# EAGLE design RQ2_mainboard (EAGLE 7.7.0)
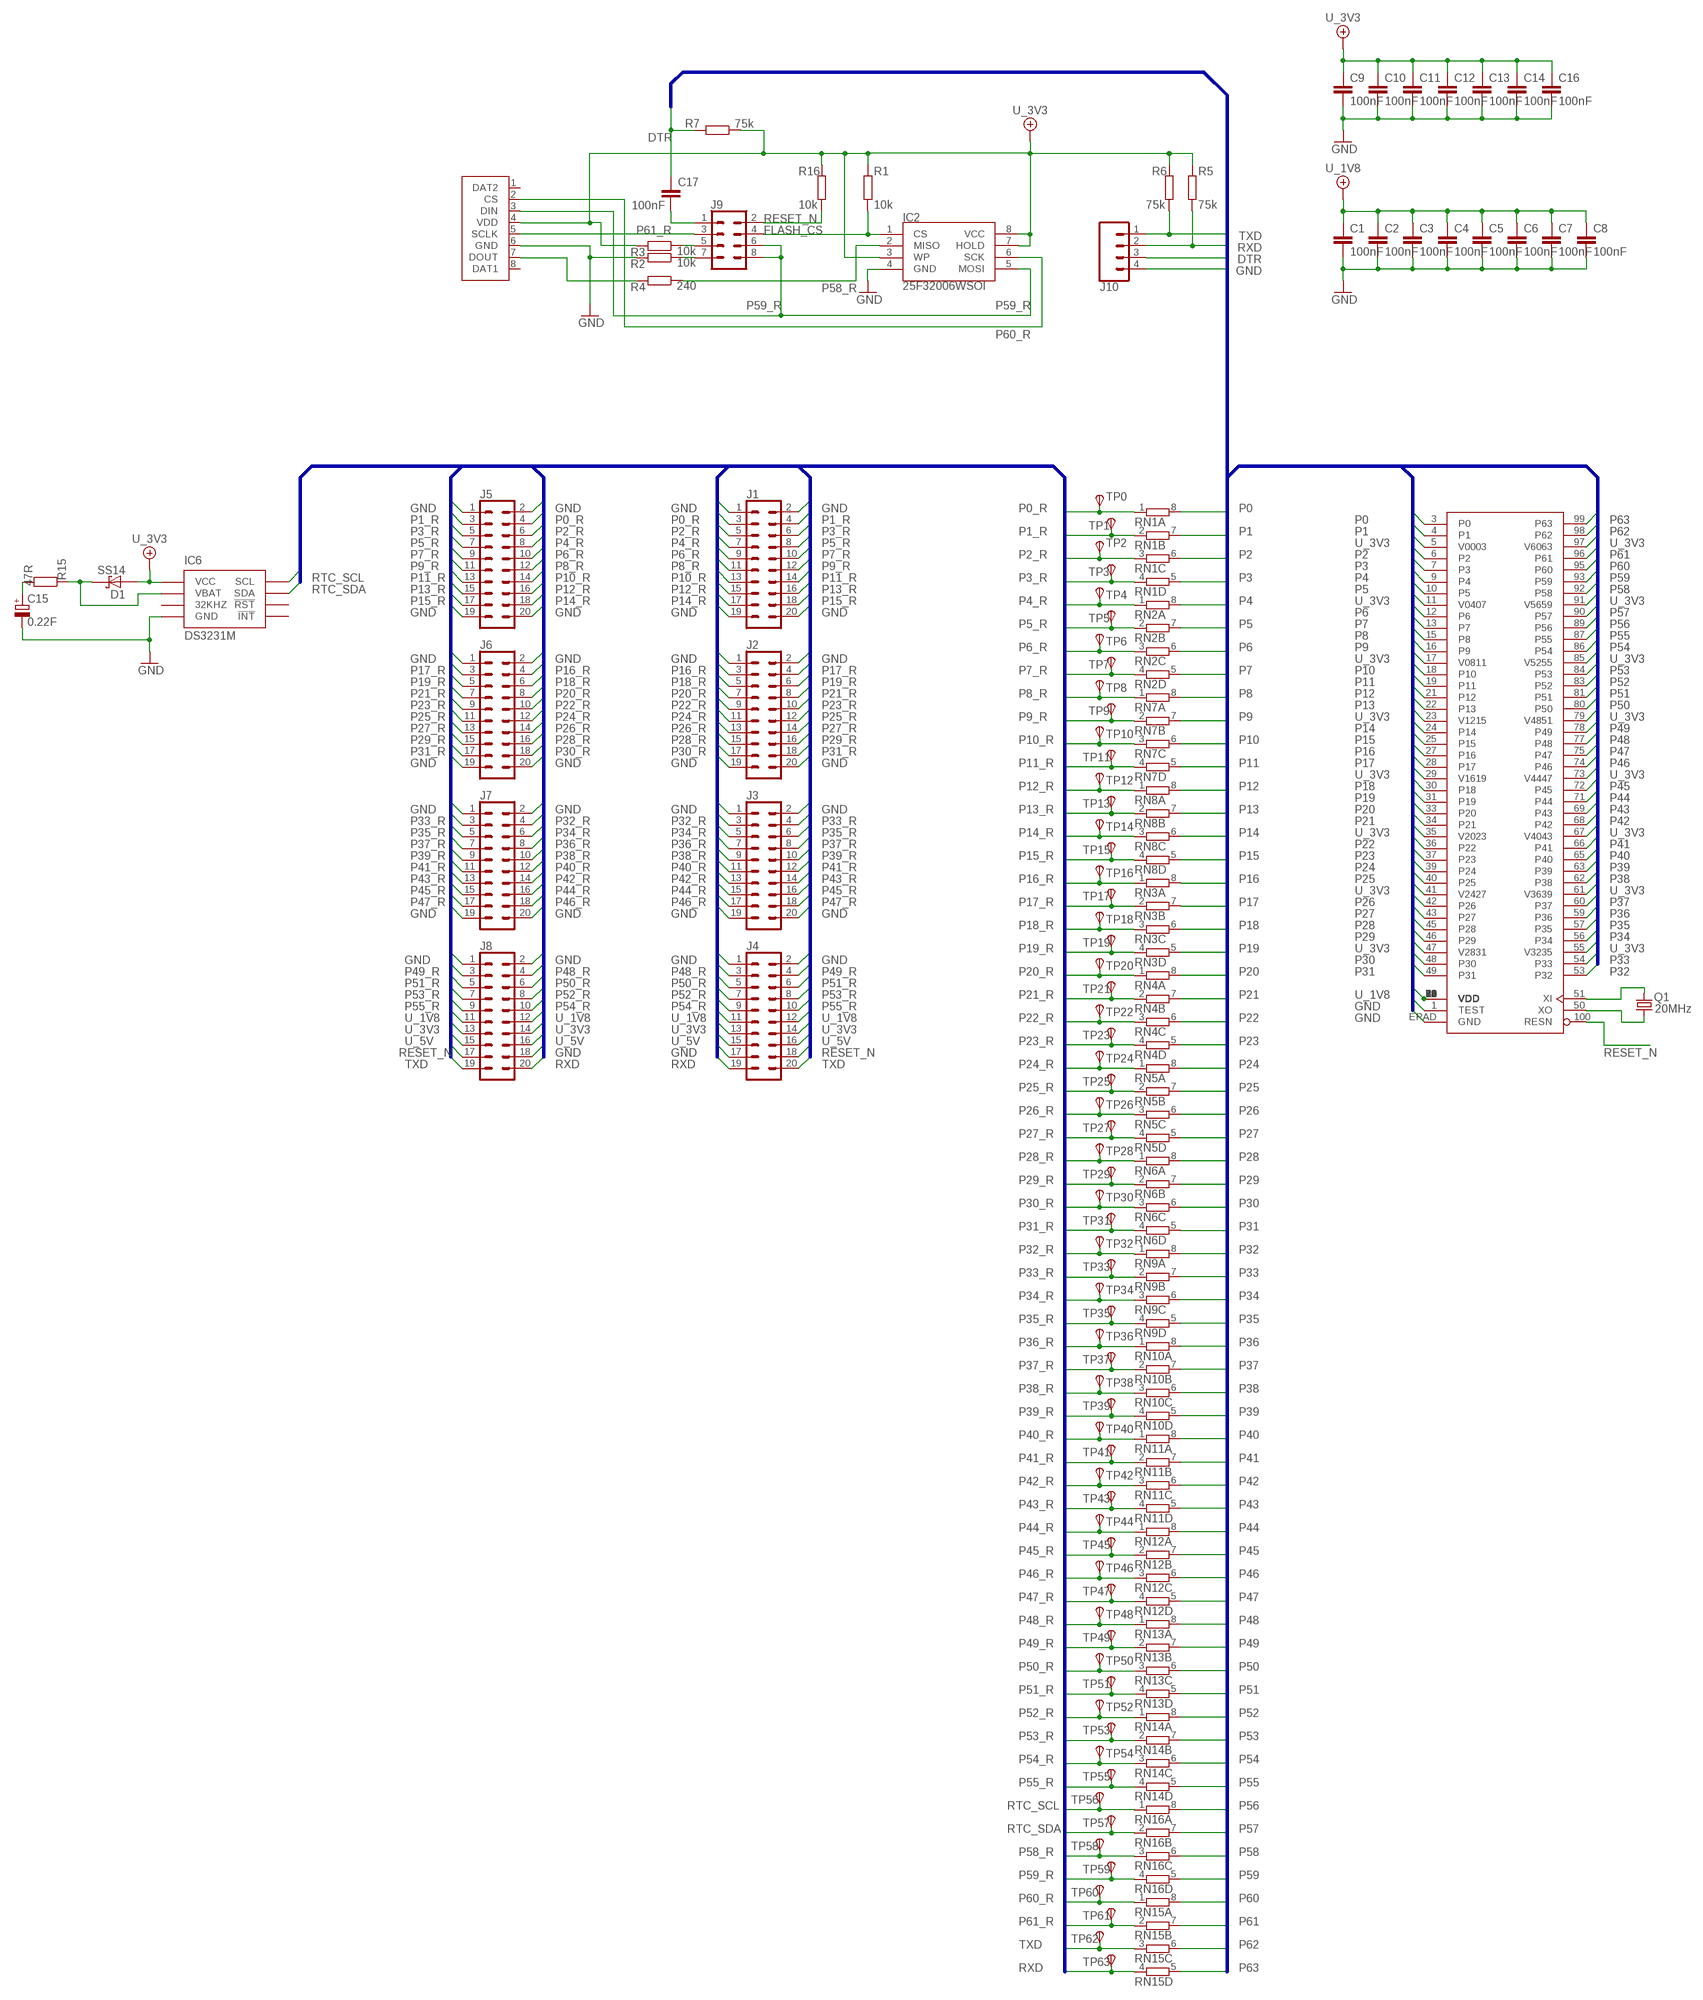
[diagram p0: schematic, sheet 1]

## Parts
C1  100nF  C-EUC0805  [C0805]
C2  100nF  C-EUC0805  [C0805]
C3  100nF  C-EUC0805  [C0805]
C4  100nF  C-EUC0805  [C0805]
C5  100nF  C-EUC0805  [C0805]
C6  100nF  C-EUC0805  [C0805]
C7  100nF  C-EUC0805  [C0805]
C8  100nF  C-EUC0805  [C0805]
C9  100nF  C-EUC0805  [C0805]
C10  100nF  C-EUC0805  [C0805]
C11  100nF  C-EUC0805  [C0805]
C12  100nF  C-EUC0805  [C0805]
C13  100nF  C-EUC0805  [C0805]
C14  100nF  C-EUC0805  [C0805]
C15  0.22F  CPOL-EUDHL_21.5  [DHL_21.5]
C16  100nF  C-EUC0805  [C0805]
C17  100nF  C-EUC0805  [C0805]
D1  SS14  [SMA_403D]
IC1  P2X8C4M64P  [TQFP100]
IC2  25F32006WSOI  SPI_FLASH-X25XXSMD1  [SO08-EIAJ]
IC6  DS3231M  [SO-8]
J1  CONN_10X2SMT  [2X10_SMT]
J2  CONN_10X2SMT  [2X10_SMT]
J3  CONN_10X2SMT  [2X10_SMT]
J4  CONN_10X2SMT  [2X10_SMT]
J5  CONN_10X2SMT  [2X10_SMT]
J6  CONN_10X2SMT  [2X10_SMT]
J7  CONN_10X2SMT  [2X10_SMT]
J8  CONN_10X2SMT  [2X10_SMT]
J9  CONN_04X2  [2X4]
J10  CONN_04  [1X04]
Q1  20MHz  CRYSTALSMD-5X3.2-2PAD  [CRYSTAL-SMD-5X3.2-2PAD]
R1  10k  R-EU_R0603  [R0603]
R2  10k  R-EU_R0603  [R0603]
R3  10k  R-EU_R0603  [R0603]
R4  240  R-EU_R0603  [R0603]
R5  75k  R-EU_R0603  [R0603]
R6  75k  R-EU_R0603  [R0603]
R7  75k  R-EU_R0603  [R0603]
R15  47R  R-EU_R0603  [R0603]
R16  10k  R-EU_R0603  [R0603]
RN1  4R-N0603-ARV  [0603-ARV]
RN2  4R-N0603-ARV  [0603-ARV]
RN3  4R-N0603-ARV  [0603-ARV]
RN4  4R-N0603-ARV  [0603-ARV]
RN5  4R-N0603-ARV  [0603-ARV]
RN6  4R-N0603-ARV  [0603-ARV]
RN7  4R-N0603-ARV  [0603-ARV]
RN8  4R-N0603-ARV  [0603-ARV]
RN9  4R-N0603-ARV  [0603-ARV]
RN10  4R-N0603-ARV  [0603-ARV]
RN11  4R-N0603-ARV  [0603-ARV]
RN12  4R-N0603-ARV  [0603-ARV]
RN13  4R-N0603-ARV  [0603-ARV]
RN14  4R-N0603-ARV  [0603-ARV]
RN15  4R-N0603-ARV  [0603-ARV]
RN16  4R-N0603-ARV  [0603-ARV]
TP0  TPSB1,27  [B1,27]
TP1  TPSB1,27  [B1,27]
TP2  TPSB1,27  [B1,27]
TP3  TPSB1,27  [B1,27]
TP4  TPSB1,27  [B1,27]
TP5  TPSB1,27  [B1,27]
TP6  TPSB1,27  [B1,27]
TP7  TPSB1,27  [B1,27]
TP8  TPSB1,27  [B1,27]
TP9  TPSB1,27  [B1,27]
TP10  TPSB1,27  [B1,27]
TP11  TPSB1,27  [B1,27]
TP12  TPSB1,27  [B1,27]
TP13  TPSB1,27  [B1,27]
TP14  TPSB1,27  [B1,27]
TP15  TPSB1,27  [B1,27]
TP16  TPSB1,27  [B1,27]
TP17  TPSB1,27  [B1,27]
TP18  TPSB1,27  [B1,27]
TP19  TPSB1,27  [B1,27]
TP20  TPSB1,27  [B1,27]
TP21  TPSB1,27  [B1,27]
TP22  TPSB1,27  [B1,27]
TP23  TPSB1,27  [B1,27]
TP24  TPSB1,27  [B1,27]
TP25  TPSB1,27  [B1,27]
TP26  TPSB1,27  [B1,27]
TP27  TPSB1,27  [B1,27]
TP28  TPSB1,27  [B1,27]
TP29  TPSB1,27  [B1,27]
TP30  TPSB1,27  [B1,27]
TP31  TPSB1,27  [B1,27]
TP32  TPSB1,27  [B1,27]
TP33  TPSB1,27  [B1,27]
TP34  TPSB1,27  [B1,27]
TP35  TPSB1,27  [B1,27]
TP36  TPSB1,27  [B1,27]
TP37  TPSB1,27  [B1,27]
TP38  TPSB1,27  [B1,27]
TP39  TPSB1,27  [B1,27]
TP40  TPSB1,27  [B1,27]
TP41  TPSB1,27  [B1,27]
TP42  TPSB1,27  [B1,27]
TP43  TPSB1,27  [B1,27]
TP44  TPSB1,27  [B1,27]
TP45  TPSB1,27  [B1,27]
TP46  TPSB1,27  [B1,27]
TP47  TPSB1,27  [B1,27]
TP48  TPSB1,27  [B1,27]
TP49  TPSB1,27  [B1,27]
TP50  TPSB1,27  [B1,27]
TP51  TPSB1,27  [B1,27]
TP52  TPSB1,27  [B1,27]
TP53  TPSB1,27  [B1,27]
TP54  TPSB1,27  [B1,27]
TP55  TPSB1,27  [B1,27]
TP56  TPSB1,27  [B1,27]
TP57  TPSB1,27  [B1,27]
TP58  TPSB1,27  [B1,27]
TP59  TPSB1,27  [B1,27]
TP60  TPSB1,27  [B1,27]
TP61  TPSB1,27  [B1,27]
TP62  TPSB1,27  [B1,27]
TP63  TPSB1,27  [B1,27]
X1  MICRO_SD_CONNECTORMOLEX_HINGE  [MICRO_SD]

## Nets
DTR: C17.1 J10.3 R7.2
DTR_C: C17.2 J9.1
FLASH_CS: IC2.1(CS) J9.4 R1.1
GND: C1.2 C2.2 C3.2 C4.2 C5.2 C6.2 C7.2 C8.2 C9.2 C10.2 C11.2 C12.2 C13.2 C14.2 C15.- C16.2 IC1.1(TEST) IC1.EPAD(GND) IC2.4(GND) IC6.5(GND) J1.1 J1.2 J1.19 J1.20 J2.1 J2.2 J2.19 J2.20 J3.1 J3.2 J3.19 J3.20 J4.1 J4.2 J4.17 J5.1 J5.2 J5.19 J5.20 J6.1 J6.2 J6.19 J6.20 J7.1 J7.2 J7.19 J7.20 J8.1 J8.2 J8.18 J10.4 R2.2 X1.6(GND)
N$7: J9.7 R2.1
N$8: J9.5 R3.1
P0: IC1.3(P0) RN1.8
P0_R: J1.3 J5.4 RN1.1 TP0.TP(PP)
P1: IC1.4(P1) RN1.7
P1_R: J1.4 J5.3 RN1.2 TP1.TP(PP)
P2: IC1.6(P2) RN1.6
P2_R: J1.5 J5.6 RN1.3 TP2.TP(PP)
P3: IC1.7(P3) RN1.5
P3_R: J1.6 J5.5 RN1.4 TP3.TP(PP)
P4: IC1.9(P4) RN2.8
P4_R: J1.7 J5.8 RN2.1 TP4.TP(PP)
P5: IC1.10(P5) RN2.7
P5_R: J1.8 J5.7 RN2.2 TP5.TP(PP)
P6: IC1.12(P6) RN2.6
P6_R: J1.9 J5.10 RN2.3 TP6.TP(PP)
P7: IC1.13(P7) RN2.5
P7_R: J1.10 J5.9 RN2.4 TP7.TP(PP)
P8: IC1.15(P8) RN7.8
P8_R: J1.11 J5.12 RN7.1 TP8.TP(PP)
P9: IC1.16(P9) RN7.7
P9_R: J1.12 J5.11 RN7.2 TP9.TP(PP)
P10: IC1.18(P10) RN7.6
P10_R: J1.13 J5.14 RN7.3 TP10.TP(PP)
P11: IC1.19(P11) RN7.5
P11_R: J1.14 J5.13 RN7.4 TP11.TP(PP)
P12: IC1.21(P12) RN8.8
P12_R: J1.15 J5.16 RN8.1 TP12.TP(PP)
P13: IC1.22(P13) RN8.7
P13_R: J1.16 J5.15 RN8.2 TP13.TP(PP)
P14: IC1.24(P14) RN8.6
P14_R: J1.17 J5.18 RN8.3 TP14.TP(PP)
P15: IC1.25(P15) RN8.5
P15_R: J1.18 J5.17 RN8.4 TP15.TP(PP)
P16: IC1.27(P16) RN3.8
P16_R: J2.3 J6.4 RN3.1 TP16.TP(PP)
P17: IC1.28(P17) RN3.7
P17_R: J2.4 J6.3 RN3.2 TP17.TP(PP)
P18: IC1.30(P18) RN3.6
P18_R: J2.5 J6.6 RN3.3 TP18.TP(PP)
P19: IC1.31(P19) RN3.5
P19_R: J2.6 J6.5 RN3.4 TP19.TP(PP)
P20: IC1.33(P20) RN4.8
P20_R: J2.7 J6.8 RN4.1 TP20.TP(PP)
P21: IC1.34(P21) RN4.7
P21_R: J2.8 J6.7 RN4.2 TP21.TP(PP)
P22: IC1.36(P22) RN4.6
P22_R: J2.9 J6.10 RN4.3 TP22.TP(PP)
P23: IC1.37(P23) RN4.5
P23_R: J2.10 J6.9 RN4.4 TP23.TP(PP)
P24: IC1.39(P24) RN5.8
P24_R: J2.11 J6.12 RN5.1 TP24.TP(PP)
P25: IC1.40(P25) RN5.7
P25_R: J2.12 J6.11 RN5.2 TP25.TP(PP)
P26: IC1.42(P26) RN5.6
P26_R: J2.13 J6.14 RN5.3 TP26.TP(PP)
P27: IC1.43(P27) RN5.5
P27_R: J2.14 J6.13 RN5.4 TP27.TP(PP)
P28: IC1.45(P28) RN6.8
P28_R: J2.15 J6.16 RN6.1 TP28.TP(PP)
P29: IC1.46(P29) RN6.7
P29_R: J2.16 J6.15 RN6.2 TP29.TP(PP)
P30: IC1.48(P30) RN6.6
P30_R: J2.17 J6.18 RN6.3 TP30.TP(PP)
P31: IC1.49(P31) RN6.5
P31_R: J2.18 J6.17 RN6.4 TP31.TP(PP)
P32: IC1.53(P32) RN9.8
P32_R: J3.3 J7.4 RN9.1 TP32.TP(PP)
P33: IC1.54(P33) RN9.7
P33_R: J3.4 J7.3 RN9.2 TP33.TP(PP)
P34: IC1.56(P34) RN9.6
P34_R: J3.5 J7.6 RN9.3 TP34.TP(PP)
P35: IC1.57(P35) RN9.5
P35_R: J3.6 J7.5 RN9.4 TP35.TP(PP)
P36: IC1.59(P36) RN10.8
P36_R: J3.7 J7.8 RN10.1 TP36.TP(PP)
P37: IC1.60(P37) RN10.7
P37_R: J3.8 J7.7 RN10.2 TP37.TP(PP)
P38: IC1.62(P38) RN10.6
P38_R: J3.9 J7.10 RN10.3 TP38.TP(PP)
P39: IC1.63(P39) RN10.5
P39_R: J3.10 J7.9 RN10.4 TP39.TP(PP)
P40: IC1.65(P40) RN11.8
P40_R: J3.11 J7.12 RN11.1 TP40.TP(PP)
P41: IC1.66(P41) RN11.7
P41_R: J3.12 J7.11 RN11.2 TP41.TP(PP)
P42: IC1.68(P42) RN11.6
P42_R: J3.13 J7.14 RN11.3 TP42.TP(PP)
P43: IC1.69(P43) RN11.5
P43_R: J3.14 J7.13 RN11.4 TP43.TP(PP)
P44: IC1.71(P44) RN12.8
P44_R: J3.15 J7.16 RN12.1 TP44.TP(PP)
P45: IC1.72(P45) RN12.7
P45_R: J3.16 J7.15 RN12.2 TP45.TP(PP)
P46: IC1.74(P46) RN12.6
P46_R: J3.17 J7.18 RN12.3 TP46.TP(PP)
P47: IC1.75(P47) RN12.5
P47_R: J3.18 J7.17 RN12.4 TP47.TP(PP)
P48: IC1.77(P48) RN13.8
P48_R: J4.3 J8.4 RN13.1 TP48.TP(PP)
P49: IC1.78(P49) RN13.7
P49_R: J4.4 J8.3 RN13.2 TP49.TP(PP)
P50: IC1.80(P50) RN13.6
P50_R: J4.5 J8.6 RN13.3 TP50.TP(PP)
P51: IC1.81(P51) RN13.5
P51_R: J4.6 J8.5 RN13.4 TP51.TP(PP)
P52: IC1.83(P52) RN14.8
P52_R: J4.7 J8.8 RN14.1 TP52.TP(PP)
P53: IC1.84(P53) RN14.7
P53_R: J4.8 J8.7 RN14.2 TP53.TP(PP)
P54: IC1.86(P54) RN14.6
P54_R: J4.9 J8.10 RN14.3 TP54.TP(PP)
P55: IC1.87(P55) RN14.5
P55_R: J4.10 J8.9 RN14.4 TP55.TP(PP)
P56: IC1.89(P56) RN16.8
P57: IC1.90(P57) RN16.7
P58: IC1.92(P58) RN16.6
P58_R: IC2.2(MISO) R4.1 RN16.3 TP58.TP(PP)
P59: IC1.93(P59) RN16.5
P59_R: IC2.5(MOSI) J9.6 J9.8 RN16.4 TP59.TP(PP) X1.3(DIN)
P60: IC1.95(P60) RN15.8
P60_R: IC2.6(SCK) RN15.1 TP60.TP(PP) X1.2(CS)
P61: IC1.96(P61) RN15.7
P61_R: J9.3 RN15.2 TP61.TP(PP) X1.5(SCLK)
P62: IC1.98(P62) RN15.6
P63: IC1.99(P63) RN15.5
RESET_N: IC1.100(RESN) J4.18 J8.17 J9.2 R16.1
RTC_SCL: IC6.8(SCL) RN16.1 TP56.TP(PP)
RTC_SDA: IC6.7(SDA) RN16.2 TP57.TP(PP)
RXD: J4.19 J8.20 J10.2 R5.1 RN15.4 TP63.TP(PP)
SD_DOUT: R4.2 X1.7(DOUT)
TXD: J4.20 J8.19 J10.1 R6.1 RN15.3 TP62.TP(PP)
U_1V8: C1.1 C2.1 C3.1 C4.1 C5.1 C6.1 C7.1 C8.1 IC1.2(VDD) J4.11 J4.12 J8.11 J8.12
U_3V3: C9.1 C10.1 C11.1 C12.1 C13.1 C14.1 C16.1 D1.A IC1.5(V0003) IC1.11(V0407) IC1.17(V0811) IC1.23(V1215) IC1.29(V1619) IC1.35(V2023) IC1.41(V2427) IC1.47(V2831) IC1.55(V3235) IC1.61(V3639) IC1.67(V4043) IC1.73(V4447) IC1.79(V4851) IC1.85(V5255) IC1.91(V5659) IC1.97(V6063) IC2.3(WP) IC2.7(HOLD) IC2.8(VCC) IC6.2(VCC) J4.13 J4.14 J8.13 J8.14 R1.2 R3.2 R5.2 R6.2 R7.1 R16.2 X1.4(VDD)
U_5V: J4.15 J4.16 J8.15 J8.16
VBAT: D1.C IC6.6(VBAT) R15.1
VCAP: C15.+ R15.2
XIN: IC1.51(XI) Q1.P$2
XOUT: IC1.50(XO) Q1.P$1
Unconnected: IC6.1(32KHZ) IC6.3(!INT) IC6.4(!RST) X1.1(DAT2) X1.8(DAT1)

## Buses
P[0..63],RAM_A_CS,FLASH_A_CS,RAM_B_CS,FLASH_B_CS,FLASH_A_INT,FLASH_B_INT,SPI_SCLK[0..3],SPI_MOSI[0..3],SPI_MISO[0..3],SPI_SS[0..3],I2C_SCL[0..3],I2C_SDA[0..3],SD0_CLK,SD0_CMD,SD0_DAT[0..3],SD1_CLK,SD1_CMD,SD1_DAT[0..3],GPIO[0..15],PWM[0..7],UART_RX[0..3],UART_TX[0..3],RXD,TXD,BOOT_SCLK,BOOT_MISO,BOOT_MOSI,SD_CLK,RESET_N,DTR,XIN,XOUT,U_1V8,U_3V3,U_5V,U_IN,GND
P40_R,P41_R,P42_R,P43_R,P44_R,P45_R,P46_R,P47_R,P48_R,P49_R,P50_R,P51_R,P52_R,P53_R,P54_R,P55_R,I2C_SCL[0..3],I2C_SDA[0..3],RTC_SCL,RTC_SDA,SD_CLK,SD_CMD,SD_DAT[0..3],GPIO[0..7],ADC[0..7],PWM[0..15],UART_RX[0..3],UART_TX[0..3],PORT[0..7],RXD,TXD,BOOT_SCLK,BOOT_MISO,BOOT_MOSI,RESET_N,XIN,XOUT,U_1V8,U_3V3,U_5V,U_IN,GND

## Power pins joined to a net without a drawn wire
U_1V8: IC1.8(VDD) IC1.14(VDD) IC1.20(VDD) IC1.26(VDD) IC1.32(VDD) IC1.38(VDD) IC1.44(VDD) IC1.52(VDD) IC1.58(VDD) IC1.64(VDD) IC1.70(VDD) IC1.76(VDD) IC1.82(VDD) IC1.88(VDD) IC1.94(VDD)

## Library data of the parts
C1-C14 C16 C17 = rcl:C-EU: CAPACITOR, European symbol
C15 = rcl_updated:CPOL-EU: POLARIZED CAPACITOR, European symbol
D1 = adafruit:SS14
IC1 = parallax:P2X8C4M64P
IC2 = SparkFun-IC-Memory:SPI_FLASH-X25XX: 32M Serial Flash Memory 8pin SPI Flash series x25xx. Works with devices like W25X32 and BR25L32 Datasheet <http://www.macronix.com/Lists/Datasheet/Attachments/5031/MX25L3206E,%203V,%2032Mb,%20v1.5.pdf> SparkFun Products SparkFun Venus GPS Logger <https://www.sparkfun.com/products/10920> (GPS-10920); PROD_ID: IC-09109
IC6 = DS3231:DS3231M
J1-J8 = SparkFun-Connectors:CONN_10X2: Multi connection point. Often used as Generic Header-pin footprint for 0.1 inch spaced/style header connections On any of the 0.1 inch spaced packages, you can populate with these: Break Away Headers - Straight <https://www.sparkfun.com/products/116> (PRT-00116) Break Away Male Headers - Right Angle <https://www.sparkfun.com/products/553> (PRT-00553) Female Headers <https://www.sparkfun.com/products/115> (PRT-00115) Break Away Headers - Machine Pin <https://www.sparkfun.com/products/117> (PRT-00117) Break Away Female Headers - Swiss Machine Pin <https://www.sparkfun.com/products/743> (PRT-00743) Special note about the "SPECIAL" package: This was SPECIALLY designed to be used with our Graphic LCD Backpack. Be sure you want to use this! It is not only staggered on each line of header holes, but IT IS ALSO offset of the center point of the top and bottom lines by 5 mil. This causes the headers to lock into place on the "standard" footprint on the LCD screen. The extra squares on the tdocu layer are there simply to reference other pins (if you were to actually populate a longer header than ten long - this is what we do with the backpacks).
J9 = SparkFun-Connectors:CONN_04X2: Multi connection point. Often used as Generic Header-pin footprint for 0.1 inch spaced/style header connections On any of the 0.1 inch spaced packages, you can populate with these: Break Away Headers - Straight <https://www.sparkfun.com/products/116> (PRT-00116) Break Away Male Headers - Right Angle <https://www.sparkfun.com/products/553> (PRT-00553) Female Headers <https://www.sparkfun.com/products/115> (PRT-00115) Break Away Headers - Machine Pin <https://www.sparkfun.com/products/117> (PRT-00117) Break Away Female Headers - Swiss Machine Pin <https://www.sparkfun.com/products/743> (PRT-00743)
J10 = SparkFun-Connectors:CONN_04: Multi connection point. Often used as Generic Header-pin footprint for 0.1 inch spaced/style header connections On any of the 0.1 inch spaced packages, you can populate with these: Break Away Headers - Straight <https://www.sparkfun.com/products/116> (PRT-00116) Break Away Male Headers - Right Angle <https://www.sparkfun.com/products/553> (PRT-00553) Female Headers <https://www.sparkfun.com/products/115> (PRT-00115) Break Away Headers - Machine Pin <https://www.sparkfun.com/products/117> (PRT-00117) Break Away Female Headers - Swiss Machine Pin <https://www.sparkfun.com/products/743> (PRT-00743) For SCREWTERMINALS and SPRING TERMINALS visit here: Screw Terimnals on SparkFun.com <https://www.sparkfun.com/search/results?term=Screw+Terminals> (5mm/3.5mm/2.54mm spacing) This device is also useful as a general connection point to wire up your design to another part of your project. Our various solder wires solder well into these plated through hole pads. Hook-Up Wire - Assortment (Stranded, 22 AWG) <https://www.sparkfun.com/products/11375> (PRT-11375) Hook-Up Wire - Assortment (Solid Core, 22 AWG) <https://www.sparkfun.com/products/11367> (PRT-11367) View the entire wire category on our website here <https://www.sparkfun.com/categories/141> Special notes: Molex polarized connector foot print use with SKU : PRT-08231 with associated crimp pins and housings. 1MM SMD Version SKU: PRT-10208; PROD_ID: CONN-09696
Q1 = SparkFun-Clocks:CRYSTAL: Crystals (Generic) These are passive quartz crystals, which can be used as a clock source for a microcontroller. Crystal's are two-terminal devices. They require external "load" capacitors to generate an oscillating signal.
R1-R7 R15 R16 = rcl:R-EU_: RESISTOR, European symbol
RN1-RN16 = resistor-dil:4R-N: Array Chip Resistor Source: RS Component / Phycomp; OC_FARNELL: unknown; OC_NEWARK: unknown
TP0 TP1-TP63 = testpad:TPS: TEST PIN
X1 = connector:MICRO_SD_CONNECTOR

## Board
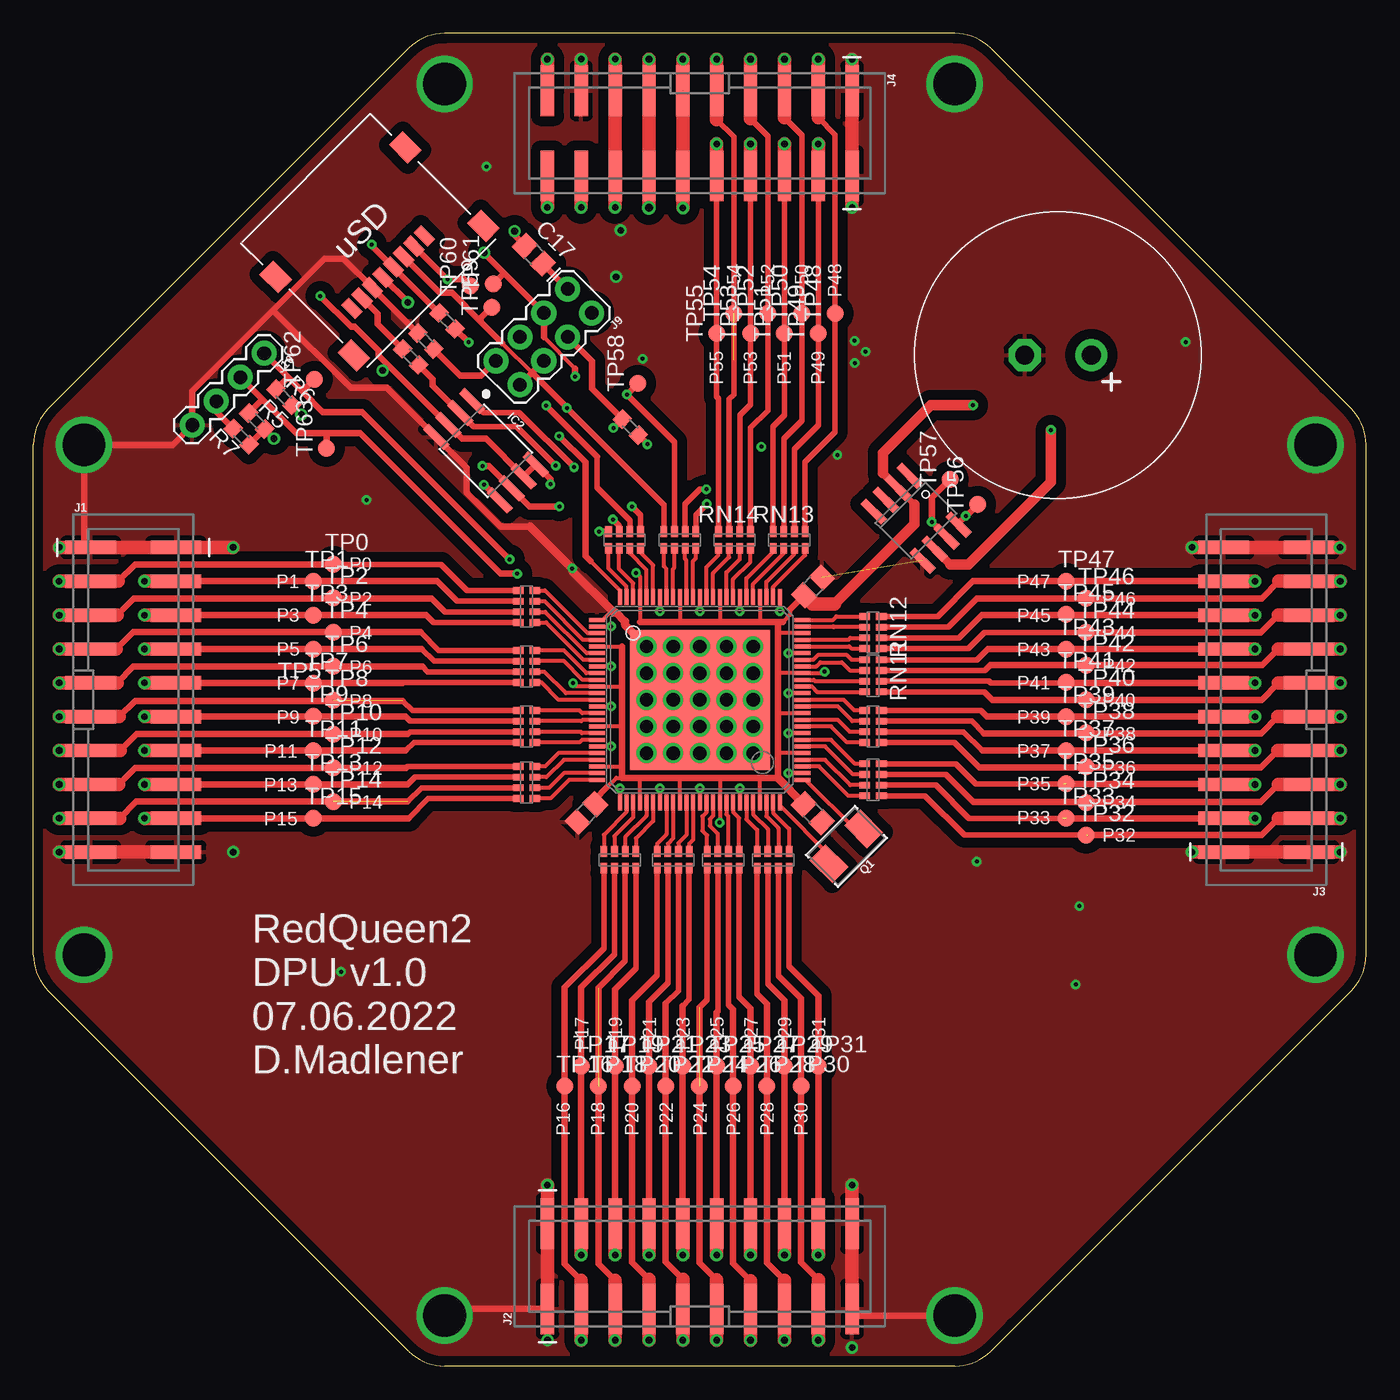
[diagram p1: board, top side]
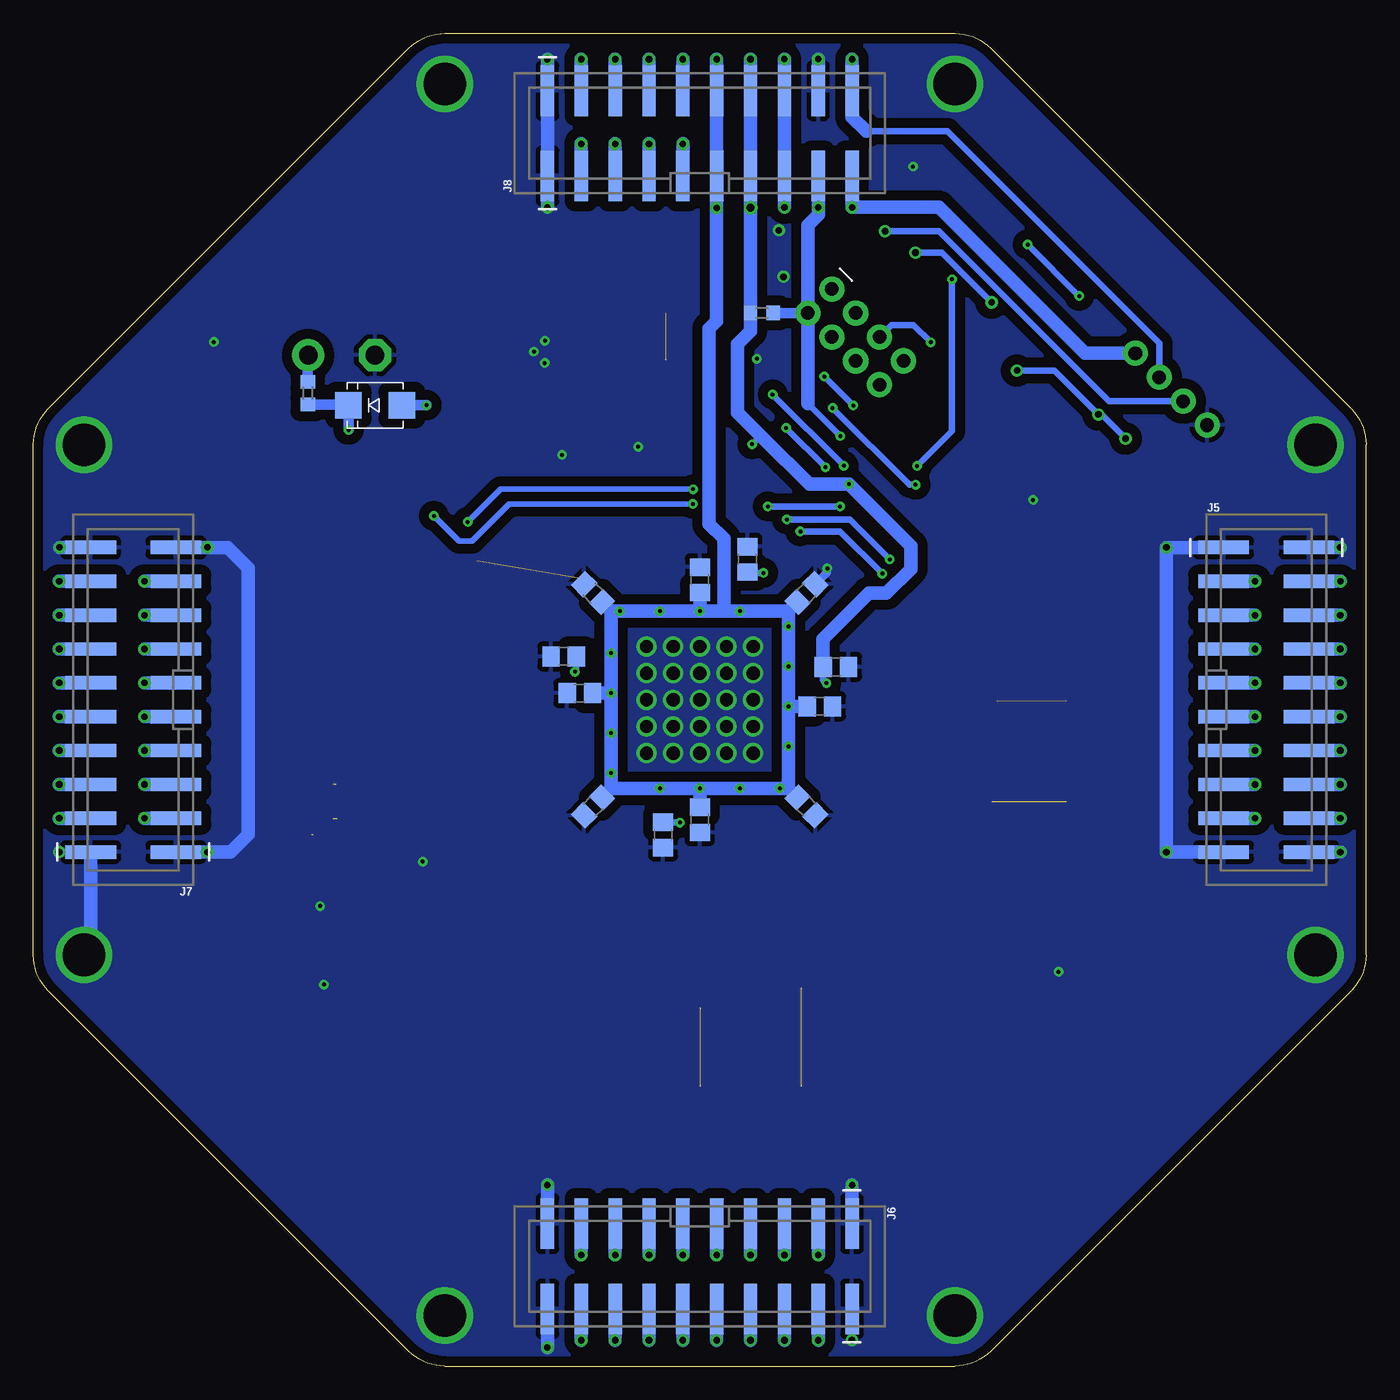
[diagram p2: board, bottom side, seen from below]

Size 100 x 100 mm. Coordinates in mm from the lower left corner, seen from the top.
Outline: 73.64,2.93 73.64,2.93
Outline: 97.07,73.64 97.07,73.64
Outline: 73.64,97.07 73.64,97.07
Outline: 98.89,28.17 arc45 100,30.86 100,69.14 arc45 98.89,71.83 71.83,98.89 arc45 69.13,100 30.86,100 arc45 28.17,98.89 1.11,71.83 arc45 0,69.14 0,30.87 arc45 1.11,28.18 28.18,1.11 arc45 30.87,0 69.13,0 arc45 71.83,1.11 98.89,28.17
Copper layers (1*16): Top 0.035mm / dielectric 1.5mm / Bottom 0.035mm
Design rules "default *": minimum track width 0.2mm, minimum drill 0.3mm, track to track 6mil, track to pad 6mil, pad to pad 6mil, via to via 6mil, smd to smd 6mil, copper to edge 6mil, drill to drill 6mil, minimum pad ring 10mil, minimum via ring 8mil, stop-mask expansion 4mil, vias tented up to drill 0mil, thermal gap 15mil

### Footprints (pad centres in the part's own frame; a part is rotated, then mirrored left to right if it is on the bottom)
C0805 = smd 1.3 x 1.5: 1 -0.95,0; 2 0.95,0
DHL_21.5 = drill 1.4 pad 2.4: + -2.5,0 | drill 1.4 pad 2.4 octagon: - 2.5,0
SMA_403D = smd 2 x 2: A 2,0; C -2,0
TQFP100 = smd 1.2 x 0.3: 1 -7.7,6; 2 -7.7,5.5; 3 -7.7,5; 4 -7.7,4.5; 5 -7.7,4; 6 -7.7,3.5; 7 -7.7,3; 8 -7.7,2.5; 9 -7.7,2; 10 -7.7,1.5; 11 -7.7,1; 12 -7.7,0.5; 13 -7.7,0; 14 -7.7,-0.5; 15 -7.7,-1; 16 -7.7,-1.5; 17 -7.7,-2; 18 -7.7,-2.5; 19 -7.7,-3; 20 -7.7,-3.5; 21 -7.7,-4; 22 -7.7,-4.5; 23 -7.7,-5; 24 -7.7,-5.5; 25 -7.7,-6; 51 7.7,-6; 52 7.7,-5.5; 53 7.7,-5; 54 7.7,-4.5; 55 7.7,-4; 56 7.7,-3.5; 57 7.7,-3; 58 7.7,-2.5; 59 7.7,-2; 60 7.7,-1.5; 61 7.7,-1; 62 7.7,-0.5; 63 7.7,0; 64 7.7,0.5; 65 7.7,1; 66 7.7,1.5; 67 7.7,2; 68 7.7,2.5; 69 7.7,3; 70 7.7,3.5; 71 7.7,4; 72 7.7,4.5; 73 7.7,5; 74 7.7,5.5; 75 7.7,6 | smd 0.3 x 1.2: 26 -6,-7.7; 27 -5.5,-7.7; 28 -5,-7.7; 29 -4.5,-7.7; 30 -4,-7.7; 31 -3.5,-7.7; 32 -3,-7.7; 33 -2.5,-7.7; 34 -2,-7.7; 35 -1.5,-7.7; 36 -1,-7.7; 37 -0.5,-7.7; 38 0,-7.7; 39 0.5,-7.7; 40 1,-7.7; 41 1.5,-7.7; 42 2,-7.7; 43 2.5,-7.7; 44 3,-7.7; 45 3.5,-7.7; 46 4,-7.7; 47 4.5,-7.7; 48 5,-7.7; 49 5.5,-7.7; 50 6,-7.7; 76 6,7.7; 77 5.5,7.7; 78 5,7.7; 79 4.5,7.7; 80 4,7.7; 81 3.5,7.7; 82 3,7.7; 83 2.5,7.7; 84 2,7.7; 85 1.5,7.7; 86 1,7.7; 87 0.5,7.7; 88 0,7.7; 89 -0.5,7.7; 90 -1,7.7; 91 -1.5,7.7; 92 -2,7.7; 93 -2.5,7.7; 94 -3,7.7; 95 -3.5,7.7; 96 -4,7.7; 97 -4.5,7.7; 98 -5,7.7; 99 -5.5,7.7; 100 -6,7.7 | smd 10.5 x 10.5: EPAD 0,0
SO08-EIAJ = smd 0.61 x 2.21: 1 -1.905,-3.378; 2 -0.635,-3.378; 3 0.635,-3.378; 4 1.905,-3.378; 5 1.905,3.353; 6 0.635,3.353; 7 -0.635,3.353; 8 -1.905,3.353
SO-8 = smd 0.6 x 2.2: 1 -1.905,-2.6; 2 -0.635,-2.6; 3 0.635,-2.6; 4 1.905,-2.6; 5 1.905,2.6; 6 0.635,2.6; 7 -0.635,2.6; 8 -1.905,2.6
2X10_SMT = smd 3.8 x 1: 1 -3.2,11.43; 2 3.2,11.43; 3 -3.2,8.89; 4 3.2,8.89; 5 -3.2,6.35; 6 3.2,6.35; 7 -3.2,3.81; 8 3.2,3.81; 9 -3.2,1.27; 10 3.2,1.27; 11 -3.2,-1.27; 12 3.2,-1.27; 13 -3.2,-3.81; 14 3.2,-3.81; 15 -3.2,-6.35; 16 3.2,-6.35; 17 -3.2,-8.89; 18 3.2,-8.89; 19 -3.2,-11.43; 20 3.2,-11.43
2X4 = drill 1.016 pad 1.88: 1 -3.81,-1.27; 2 -3.81,1.27; 3 -1.27,-1.27; 4 -1.27,1.27; 5 1.27,-1.27; 6 1.27,1.27; 7 3.81,-1.27; 8 3.81,1.27
1X04 = drill 1.016 pad 1.88: 1 0,0; 2 2.54,0; 3 5.08,0; 4 7.62,0
CRYSTAL-SMD-5X3.2-2PAD = smd 1.7 x 2.4: P$1 1.85,0; P$2 -1.85,0
R0603 = smd 1 x 1.1: 1 -0.85,0; 2 0.85,0
0603-ARV = smd 0.5 x 0.8: 1 -1.2,-0.625; 2 -0.4,-0.625; 3 0.4,-0.625; 4 1.2,-0.625; 5 1.2,0.625; 6 0.4,0.625; 7 -0.4,0.625; 8 -1.2,0.625
B1,27 = smd 1.27 x 1.27: TP 0,0
MICRO_SD = smd 0.8 x 1.5: 1 3.6,9.35; 2 4.7,9.35; 3 5.8,9.35; 4 6.9,9.35; 5 8,9.35; 6 9.1,9.35; 7 10.2,9.35; 8 11.3,9.35 | smd 1.45 x 2: SHLD0 13.675,3.65; SHLD1 13.675,11.95; SHLD2 -0.075,11.95; SHLD3 -0.075,3.65

### Placement (x,y rotation side)
C1  58,42 225 bottom
C2  58,58 135 bottom
C3  42,42 315 bottom
C4  42,58 45 bottom
C5  50,41 270 bottom
C6  41,49.5 0 bottom
C7  50,59 90 bottom
C8  59,50.5 180 bottom
C9  58.48,41.49 315 top
C10  39.79,52.46 0 bottom
C11  41.5,41.5 225 top
C12  58.5,58.5 45 top
C13  52.74,39.85 270 bottom
C14  46.42,60.53 90 bottom
C15  76.88,75.86 180 top
C16  60.2,53.26 180 bottom
C17  37.56,83.39 315 top
D1  74.36,72.1 0 bottom
IC1  50,50 0 top
IC2  33.97,68.67 225 top
IC6  66.22,63.62 225 top
J1  7.5,50 0 top
J2  50,7.5 90 top
J3  92.5,50 180 top
J4  50,92.5 270 top
J5  7.5,50 0 bottom
J6  50,7.5 270 bottom
J7  92.5,50 180 bottom
J8  50,92.5 90 bottom
J9  38.3,77.22 225 top
J10  17.32,76 225 top
Q1  61,39 225 top
R1  44.79,70.45 315 top
R2  29.45,76.9 135 top
R3  31.05,78.42 135 top
R4  28.3,75.72 135 top
R5  16.75,70.9 315 top
R6  18.8,72.7 315 top
R7  15.6,69.75 135 top
R15  79.41,73 90 bottom
R16  45.35,79.02 180 bottom
RN1  37,57 270 top
RN2  37,52.5 270 top
RN3  44,38 0 top
RN4  48,38 0 top
RN5  51.75,38 0 top
RN6  55.5,38 0 top
RN7  37,48 270 top
RN8  37,43.8 270 top
RN9  63,44 90 top
RN10  63,48 90 top
RN11  63,51.8 90 top
RN12  63,55.05 90 top
RN13  56.7,62 180 top
RN14  52.6,62 180 top
RN15  44.35,62 180 top
RN16  48.5,62 180 top
TP0  22.5,60.16 0 top
TP1  21,58.88 0 top
TP2  22.5,57.65 0 top
TP3  21,56.35 0 top
TP4  22.5,55.08 0 top
TP5  21,53.8 180 top
TP6  22.5,52.52 0 top
TP7  21,51.24 0 top
TP8  22.5,49.96 0 top
TP9  21,48.78 0 top
TP10  22.5,47.4 0 top
TP11  21,46.17 0 top
TP12  22.5,44.9 0 top
TP13  21,43.65 0 top
TP14  22.5,42.36 0 top
TP15  21,41.11 0 top
TP16  39.87,21 0 top
TP17  41.11,22.5 0 top
TP18  42.4,21 0 top
TP19  43.65,22.5 0 top
TP20  44.93,21 0 top
TP21  46.19,22.5 0 top
TP22  47.44,21 0 top
TP23  48.71,22.5 0 top
TP24  49.98,21 0 top
TP25  51.27,22.5 0 top
TP26  52.51,21 0 top
TP27  53.81,22.5 0 top
TP28  55.03,21 0 top
TP29  56.35,22.5 0 top
TP30  57.59,21 0 top
TP31  58.89,22.5 0 top
TP32  79,39.84 0 top
TP33  77.5,41.11 0 top
TP34  79,42.28 0 top
TP35  77.5,43.7 0 top
TP36  79,44.97 0 top
TP37  77.5,46.19 0 top
TP38  79,47.51 0 top
TP39  77.5,48.73 0 top
TP40  79,50 0 top
TP41  77.5,51.3 0 top
TP42  79,52.6 0 top
TP43  77.5,53.8 0 top
TP44  79,55.05 0 top
TP45  77.5,56.4 0 top
TP46  79,57.6 0 top
TP47  77.5,58.89 0 top
TP48  60.15,79 90 top
TP49  58.89,77.5 90 top
TP50  57.65,79 90 top
TP51  56.35,77.5 90 top
TP52  55.1,79 90 top
TP53  53.81,77.5 90 top
TP54  52.55,79 90 top
TP55  51.27,77.5 90 top
TP56  70.85,64.65 90 top
TP57  68.8,66.55 90 top
TP58  45.36,73.74 90 top
TP59  34.4,79.45 90 top
TP60  32.8,81.05 90 top
TP61  34.5,81.2 90 top
TP62  21.1,74.05 90 top
TP63  22,68.85 90 top
X1  25.27,93.96 225 top

### Tracks (layer width: path | path; a pad name or v marks a point on that pad's centre or on a via)
DTR  (via drill 0.5)
  Top 0.5: R7.2 13.73,71.62 J10.3 | C17.1 36.1,84.85 v36.1,85.15
  Bottom 0.5: J10.3 19.3,72.4 32.05,85.15 v36.1,85.15
DTR_C
  Top 0.5: J9.1 38.23,82.68 C17.2
FLASH_CS  (via drill 0.3)
  Top 0.4: v40.57,67.44 36.46,71.56 33.78,71.56 IC2.1
  Top 0.5: J9.4 41.91,75.41 41.91,73.33 R1.1 v43.52,70.39
  Bottom 0.5: v40.57,67.44 v43.52,70.39
GND  (via drill 0.3, 0.5, 1, 3.2)  (1 unrouted)
  Top 0.3: 44.98,55.02 IC1.EPAD | IC1.1 42.71,56 43.4,56.69 | 92.94,61.45 92.95,61.43
  Top 0.406: 17.99,79.21 17.99,79.22
  Top 0.5: 32.52,67.43 32.52,65.55 35.07,63 37.28,63 | 61.43,88.94 61.4,88.91 | 26.55,73.4 23.8,73.4 17.99,79.21 | 43.56,56.53 43.4,56.69 | 40.42,59.67 v40.42,59.85 | X1.6 23.26,83.11 21.87,83.11 17.99,79.22 11.93,73.17 J10.4 10.45,69.12 v3.8,69.12 3.8,61.93 J5.2 | X1.6 | v30.86,3.8 31.36,4.3 J6.2 | J6.20 61.93,3.8 v69.12,3.8 | 26.55,73.4 | 26.55,73.4 IC2.4 32.52,67.43 | 32.52,67.43 | R2.2 25.45,80.9 X1.6
  Top 0.6: 44.98,55.02 44.4,55.6 44.4,55.88 43.75,56.53 43.56,56.53 | 43.4,56.69 40.42,59.67 | 37.28,63 v40.42,59.85
  Top 1: J6.20 J6.19 v61.43,13.6 | J6.2 J6.1 v38.57,13.6 | J5.19 J5.20 v1.94,38.57 | v98.06,38.57 J7.2 J7.1 v86.94,38.57 | v98.03,61.43 J7.20 92.95,61.43 J7.19 | v61.43,98.06 J8.2 61.43,88.94 | J8.1 v61.43,86.94 | 88.93,61.44 v86.94,61.44 | v1.94,61.43 J5.2 J5.1 v14.99,61.43 | v41.11,98.06 J4.17
  Bottom 0.6: C4.2 40.42,59.58 v40.42,59.85
  Bottom 0.8: v14.99,38.57 v14.99,38.58
  Bottom 1: J6.20 v61.43,1.4 | J6.1 v38.57,13.6 | J6.19 v61.43,13.6 | J5.20 v1.94,38.57 | v1.94,61.43 J5.2 | v14.99,38.58 v14.99,61.43 J5.1 | J5.19 v14.99,38.57 | v61.43,86.94 J8.1 J8.2 v61.43,98.06 | J7.19 v86.94,61.44 85.44,61.44 83.89,59.89 83.89,39.89 85.21,38.57 v86.94,38.57 J7.1 | J7.20 v98.03,61.43 | J7.2 95.7,31.36 v96.2,30.86 | J4.17 v41.11,98.06
  other vias: 3.8,30.86 69.12,96.2 96.2,69.12 30.86,96.2 38.58,1.94 54,46 52,46 50,46 48,46 46,46 54,48 52,48 50,48 48,48 46,48 54,50 52,50 50,50 48,50 46,50 54,52 52,52 50,52 48,52 46,52 54,54 52,54 50,54 48,54 46,54 25,65 23.08,29.59 61.63,75.27 62.45,76.12 43.72,81.73 44.07,85.22 86.45,76.85 34,90 78.48,34.52 70.78,37.86 54.62,68.99 45.72,75.58 60.33,68.36 61.61,76.94 78.2,28.63
  pour Top (isolate 0.75): 100.01,29.33 70.7,0 29.3,0 0,29.3 0,70.7 29.3,100 70.7,100 100.01,70.73
  pour Bottom (isolate 0.75): 0.01,29.34 29.31,0.03 70.71,0.03 100.01,29.33 100.01,70.73 70.71,100.03 29.31,100.03 0.01,70.73
N$7
  Top 0.5: J9.7 33.6,74.32 32.02,74.32 R2.1
N$8  (via drill 0.3)
  Top 0.3: v32.66,76.81
  Top 0.5: R3.1 v32.66,76.81
  Bottom 0.5: v32.66,76.81 33.97,78.12 35.6,78.12 J9.5
P0
  Top 0.3: IC1.3 41.59,55 38.38,58.2 RN1.8
P0_R  (via drill 0.5)
  Top 0.4: 30.59,60.16 TP0.TP
  Top 0.406: 30.59,60.16 32.55,58.2 RN1.1
  Top 0.5: TP0.TP 7.65,60.16 6.38,58.89
  Top 1: 6.38,58.89 J5.4 v1.94,58.89
  Bottom 1: v1.94,58.89 J5.4
P1
  Top 0.3: IC1.4 41.26,54.5 38.36,57.4 RN1.7
P1_R  (via drill 0.5)
  Top 0.4: RN1.2 31.79,57.4 30.3,58.89
  Top 0.5: 30.3,58.89 21.35,58.89 TP1.TP | TP1.TP J5.3 | TP1.TP
  Top 1: J5.3 v8.34,58.89
  Bottom 1: v8.34,58.89 J5.3
P2
  Top 0.3: IC1.6 41.51,53.5 38.41,56.6 RN1.6
P2_R  (via drill 0.5)
  Top 0.4: RN1.3 30.89,56.6 29.89,57.6
  Top 0.5: 29.89,57.6 22.95,57.6 22.5,57.6 | 22.5,57.6 7.54,57.6 6.29,56.35 | TP2.TP 22.5,57.6
  Top 1: 6.29,56.35 J5.6 v1.94,56.35
  Bottom 1: v1.94,56.35 J5.6
P3
  Top 0.3: IC1.7 41.27,53 38.48,55.8 RN1.5
P3_R  (via drill 0.5)
  Top 0.4: RN1.4 30.02,55.8 29.47,56.35
  Top 0.5: 29.47,56.35 21.05,56.35 TP3.TP | TP3.TP J5.5 | TP3.TP
  Top 1: J5.5 v8.34,56.35
  Bottom 1: J5.5 v8.34,56.35
P4
  Top 0.3: IC1.9 41.51,52 39.8,53.7 RN2.8
P4_R  (via drill 0.5)
  Top 0.4: RN2.1 30.42,53.7 29.05,55.06
  Top 0.5: 29.05,55.06 22.6,55.06 22.5,55.06 | 22.5,55.06 7.49,55.06 6.23,53.81 | TP4.TP 22.5,55.06
  Top 1: 6.23,53.81 J5.8 v1.94,53.81
  Bottom 1: J5.8 v1.94,53.81
P5
  Top 0.3: IC1.10 41.22,51.5 39.82,52.9 RN2.7
P5_R  (via drill 0.5)
  Top 0.4: RN2.2 30.05,52.9 29.14,53.81
  Top 0.5: 29.14,53.81 21.05,53.81 TP5.TP | TP5.TP J5.7 | TP5.TP
  Top 1: J5.7 v8.34,53.81
  Bottom 1: v8.34,53.81 J5.7
P6
  Top 0.3: IC1.12 39.95,50.5 38.35,52.1 RN2.6
P6_R  (via drill 0.5)
  Top 0.4: RN2.3 29.59,52.1 29.2,52.48
  Top 0.5: 29.2,52.48 22.65,52.48 22.5,52.48 | 22.5,52.48 7.51,52.48 6.29,51.27 | TP6.TP 22.5,52.48
  Top 1: 6.29,51.27 J5.10 v1.94,51.27
  Bottom 1: v1.94,51.27 J5.10
P7
  Top 0.3: IC1.13 39.42,50 38.12,51.3 RN2.5
P7_R  (via drill 0.5)
  Top 0.4: RN2.4 27.75,51.3 27.71,51.27
  Top 0.5: 27.71,51.27 21.05,51.27 21,51.27 | 21,51.27 J5.9 | TP7.TP 21,51.27
  Top 1: J5.9 v8.34,51.27
  Bottom 1: J5.9 v8.34,51.27
P8
  Top 0.3: IC1.15 41.17,49 40.97,49.2 RN7.8
P8_R  (via drill 0.5)  (1 unrouted)
  Top 0.4: RN7.1 28.45,49.2 27.72,49.92
  Top 0.5: 27.72,49.92 7.64,49.92 6.45,48.73
  Top 1: 6.45,48.73 J5.12 v1.94,48.73
  Bottom 1: J5.12 v1.94,48.73
P9
  Top 0.3: IC1.16 41.22,48.5 41.12,48.4 RN7.7
P9_R  (via drill 0.5)
  Top 0.4: RN7.2 28.27,48.4 27.93,48.73
  Top 0.5: 27.93,48.73 21.2,48.73 21,48.73 | 21,48.73 J5.11 | TP9.TP 21,48.73
  Top 1: J5.11 v8.34,48.73
  Bottom 1: v8.34,48.73 J5.11
P10
  Top 0.3: IC1.18 41.16,47.5 41.06,47.6 RN7.6
P10_R  (via drill 0.5)
  Top 0.4: RN7.3 28.25,47.6 28.09,47.43
  Top 0.5: 28.09,47.43 22.6,47.43 22.5,47.43 | 22.5,47.43 7.74,47.43 6.5,46.19 | TP10.TP 22.5,47.43
  Top 1: 6.5,46.19 J5.14 v1.94,46.19
  Bottom 1: v1.94,46.19 J5.14
P11
  Top 0.3: IC1.19 41.18,47 40.98,46.8 RN7.5
P11_R  (via drill 0.5)
  Top 0.4: RN7.4 28.55,46.8 27.94,46.19
  Top 0.5: 27.94,46.19 21.1,46.19 21,46.19 | 21,46.19 J5.13 | TP11.TP 21,46.19
  Top 1: J5.13 v8.34,46.19
  Bottom 1: J5.13 v8.34,46.19
P12
  Top 0.3: IC1.21 39.4,46 38.4,45 RN8.8
P12_R  (via drill 0.5)
  Top 0.4: RN8.1 28.08,45 27.98,44.9
  Top 0.5: 27.98,44.9 TP12.TP 7.64,44.9 6.39,43.65
  Top 1: 6.39,43.65 J5.16 v1.94,43.65
  Bottom 1: v1.94,43.65 J5.16
P13
  Top 0.3: IC1.22 39.8,45.5 38.5,44.2 RN8.7
P13_R  (via drill 0.5)
  Top 0.4: RN8.2 28.64,44.2 28.09,43.65
  Top 0.5: 28.09,43.65 TP13.TP J5.15
  Top 1: J5.15 v8.34,43.65
  Bottom 1: v8.34,43.65 J5.15
P14
  Top 0.3: IC1.24 39.8,44.5 38.7,43.4 RN8.6
P14_R  (via drill 0.5)  (1 unrouted)
  Top 0.4: RN8.3 29.14,43.4 28.09,42.36
  Top 0.5: 28.09,42.36 7.71,42.36 6.46,41.11
  Top 1: 6.46,41.11 J5.18 v1.94,41.11
  Bottom 1: J5.18 v1.94,41.11
P15
  Top 0.3: IC1.25 40.2,44 38.8,42.6 RN8.5
P15_R  (via drill 0.5)
  Top 0.4: RN8.4 29.64,42.6 28.14,41.11
  Top 0.5: 28.14,41.11 TP15.TP J5.17
  Top 1: J5.17 v8.34,41.11
  Bottom 1: J5.17 v8.34,41.11
P16
  Top 0.3: IC1.27 44.5,41.58 42.8,39.88 RN3.8
P16_R  (via drill 0.5)
  Top 0.4: RN3.1 42.8,31.34 39.87,28.41
  Top 0.5: 41.11,6.43 39.87,7.67 TP16.TP 39.87,28.41
  Top 1: 41.11,6.43 J6.4 v41.11,1.94
  Bottom 1: J6.4 v41.11,1.94
P17
  Top 0.3: IC1.28 45,41.18 43.6,39.78 RN3.7
P17_R  (via drill 0.5)
  Top 0.4: RN3.2 43.6,30.91 41.11,28.41
  Top 0.5: 41.11,28.41 TP17.TP J6.3
  Top 1: v41.11,8.34 J6.3
  Bottom 1: J6.3 v41.11,8.34
P18
  Top 0.3: IC1.30 46,41.3 44.4,39.7 RN3.6
P18_R  (via drill 0.5)  (1 unrouted)
  Top 0.4: RN3.3 44.4,30.4 42.4,28.4
  Top 0.5: 42.4,28.4 42.4,7.7 43.65,6.45
  Top 1: v43.65,1.94 J6.6 43.65,6.45
  Bottom 1: J6.6 v43.65,1.94
P19
  Top 0.3: IC1.31 46.5,40.9 45.2,39.6 RN3.5
P19_R  (via drill 0.5)
  Top 0.4: RN3.4 45.2,29.84 43.65,28.29
  Top 0.5: 43.65,28.29 TP19.TP J6.5
  Top 1: v43.65,8.34 J6.5
  Bottom 1: J6.5 v43.65,8.34
P20
  Top 0.3: IC1.33 47.5,39.9 46.8,39.2 RN4.8
P20_R  (via drill 0.5)
  Top 0.4: RN4.1 46.8,29.32 44.93,27.45
  Top 0.5: 44.93,27.45 44.93,21.1 TP20.TP 44.93,7.78 46.19,6.52
  Top 1: 46.19,6.52 J6.8 v46.19,1.94
  Bottom 1: J6.8 v46.19,1.94
P21
  Top 0.3: IC1.34 48,39.6 47.6,39.2 RN4.7
P21_R  (via drill 0.5)
  Top 0.4: RN4.2 47.6,28.74 46.19,27.33
  Top 0.5: 46.19,27.33 46.19,22.7 TP21.TP J6.7
  Top 1: J6.7 v46.19,8.34
  Bottom 1: J6.7 v46.19,8.34
P22
  Top 0.3: RN4.6 48.4,39.25 49,39.85 IC1.36
P22_R  (via drill 0.5)
  Top 0.4: RN4.3 48.4,28.16 47.44,27.2
  Top 0.5: 47.44,27.2 47.44,21.1 TP22.TP 47.44,7.82 48.73,6.53
  Top 1: 48.73,6.53 J6.10 v48.73,1.94
  Bottom 1: J6.10 v48.73,1.94
P23
  Top 0.3: IC1.37 49.5,39.5 49.2,39.2 RN4.5
P23_R  (via drill 0.5)
  Top 0.4: RN4.4 49.2,27.52 48.73,27.05
  Top 0.5: 48.73,27.05 48.71,27.05 TP23.TP 48.71,10.7 J6.9
  Top 1: v48.73,8.34 J6.9
  Bottom 1: J6.9 v48.73,8.34
P24
  Top 0.3: IC1.39 50.5,41.55 50.2,41.25 50.2,40.17 50.55,39.82 RN5.8
P24_R  (via drill 0.5)  (1 unrouted)
  Top 0.4: RN5.1 50.55,27.48 49.98,26.91
  Top 0.5: 49.98,26.91 49.98,7.75 51.27,6.46
  Top 1: 51.27,6.46 J6.12 v51.27,1.94
  Bottom 1: J6.12 v51.27,1.94
P25
  Top 0.3: IC1.40 51,41.3 50.75,41.05 50.75,40.55 51.35,39.95 RN5.7
P25_R  (via drill 0.5)
  Top 0.4: RN5.2 51.35,26.61 51.27,26.53
  Top 0.5: 51.27,26.53 51.27,22.7 TP25.TP J6.11
  Top 1: J6.11 v51.27,8.34
  Bottom 1: J6.11 v51.27,8.34
P26
  Top 0.3: IC1.42 52,41.4 52.15,41.24 RN5.6
P26_R  (via drill 0.5)
  Top 0.4: RN5.3 52.15,27.11 52.51,26.76
  Top 0.5: 52.51,26.76 52.51,21.05 TP26.TP 52.51,7.71 53.81,6.41
  Top 1: 53.81,6.41 J6.14 v53.81,1.94
  Bottom 1: J6.14 v53.81,1.94
P27
  Top 0.3: IC1.43 52.5,41.57 52.95,41.12 RN5.5
P27_R  (via drill 0.5)
  Top 0.4: RN5.4 52.95,27.72 53.81,26.86
  Top 0.5: J6.13 TP27.TP 53.81,22.75 53.81,26.86
  Top 1: J6.13 v53.81,8.35 v53.8,8.34
  Bottom 0.5: v53.81,8.35 v53.8,8.34
  Bottom 1: J6.13 v53.81,8.35
P28
  Top 0.3: IC1.45 53.5,41.03 54.3,40.23 RN6.8
P28_R  (via drill 0.5)
  Top 0.4: RN6.1 54.3,27.93 55.03,27.2
  Top 0.5: 55.03,27.2 55.03,21.1 TP28.TP 55.03,7.78 56.35,6.46
  Top 1: 56.35,6.46 J6.16 v56.35,1.94
  Bottom 1: J6.16 v56.35,1.94
P29
  Top 0.3: IC1.46 54,41.4 55.1,40.3 RN6.7
P29_R  (via drill 0.5)
  Top 0.4: RN6.2 55.1,28.69 56.35,27.44
  Top 0.5: J6.15 TP29.TP 56.35,22.65 56.35,27.44
  Top 1: J6.15 v56.35,8.34
  Bottom 1: J6.15 v56.35,8.34
P30
  Top 0.3: IC1.48 55,41.28 55.9,40.38 RN6.6
P30_R  (via drill 0.5)
  Top 0.4: RN6.3 55.9,29.27 57.59,27.58
  Top 0.5: 57.59,27.58 57.59,21.2 TP30.TP 57.59,7.78 58.89,6.49
  Top 1: 58.89,6.49 J6.18 v58.89,1.94
  Bottom 1: J6.18 v58.89,1.94
P31
  Top 0.3: IC1.49 55.5,41.52 56.7,40.31 RN6.5
P31_R  (via drill 0.5)
  Top 0.4: RN6.4 56.7,29.98 58.89,27.79
  Top 0.5: J6.17 TP31.TP 58.89,22.6 58.89,27.79
  Top 1: J6.17 v58.89,8.35 v58.88,8.34
  Bottom 0.5: v58.89,8.35 v58.88,8.34
  Bottom 1: J6.17 v58.89,8.35
P32
  Top 0.3: RN9.8 61.15,42.8 58.95,45 IC1.53
P32_R  (via drill 0.5)  (1 unrouted)
  Top 0.4: TP32.TP 69.86,39.84 66.9,42.8 RN9.1
  Top 0.5: 93.39,41.11 92.16,39.87 79.13,39.87 79.1,39.84 79.1,39.88
  Top 1: v98.06,41.11 J7.4 93.39,41.11
  Bottom 1: v98.06,41.11 J7.4
P33
  Top 0.3: RN9.7 61.3,43.6 59.4,45.5 IC1.54
P33_R  (via drill 0.5)  (1 unrouted)
  Top 0.4: RN9.2 67.7,43.6 70.19,41.11 TP33.TP
  Top 0.5: 77.2,41.11 77.2,41.12 | TP33.TP J7.3
  Top 1: v91.66,41.11 J7.3
  Bottom 1: v91.66,41.11 J7.3
P34
  Top 0.3: RN9.6 61.5,44.4 59.4,46.5 IC1.56
P34_R  (via drill 0.5)
  Top 0.4: 70.53,42.34 68.47,44.4 RN9.3
  Top 0.5: 70.53,42.34 78.7,42.34 | 78.7,42.34 92.1,42.34 93.42,43.65 | TP34.TP 78.7,42.28 78.7,42.34
  Top 1: v98.06,43.65 J7.6 93.42,43.65
  Bottom 1: v98.06,43.65 J7.6
P35
  Top 0.3: RN9.5 61.65,45.2 59.85,47 IC1.57
P35_R  (via drill 0.5)  (1 unrouted)
  Top 0.4: RN9.4 69.2,45.2 70.7,43.7 TP35.TP | J7.5 89.25,43.7
  Top 0.5: 77.3,43.7 77.3,43.67 | 89.25,43.7 TP35.TP
  Top 1: J7.5 v91.66,43.65
  Bottom 1: v91.66,43.65 J7.5
P36
  Top 0.3: RN10.8 61.05,46.8 59.85,48 IC1.59
P36_R  (via drill 0.5)
  Top 0.4: 70.98,44.92 69.1,46.8 RN10.1
  Top 0.5: 70.98,44.92 78.8,44.92 | 78.8,44.92 92.11,44.92 93.38,46.19 | TP36.TP 78.8,44.97 78.8,44.92
  Top 1: v98.06,46.19 J7.8 93.38,46.19
  Bottom 1: v98.06,46.19 J7.8
P37
  Top 0.3: RN10.7 61.25,47.6 60.35,48.5 IC1.60
P37_R  (via drill 0.5)
  Top 0.4: 71.2,46.19 69.79,47.6 RN10.2
  Top 0.5: 71.2,46.19 TP37.TP J7.7
  Top 1: J7.7 v91.66,46.19
  Bottom 1: v91.66,46.19 J7.7
P38
  Top 0.3: RN10.6 61.45,48.4 60.35,49.5 IC1.62
P38_R  (via drill 0.5)
  Top 0.4: 71.33,47.48 70.41,48.4 RN10.3
  Top 0.5: 71.33,47.48 78.6,47.48 | 78.6,47.48 92.13,47.48 93.39,48.73 | TP38.TP 78.6,47.51 78.6,47.48
  Top 1: v98.06,48.73 J7.10 93.39,48.73
  Bottom 1: v98.06,48.73 J7.10
P39
  Top 0.3: RN10.5 61.6,49.2 60.8,50 IC1.63
P39_R  (via drill 0.5)
  Top 0.4: 71.56,48.73 71.08,49.2 RN10.4
  Top 0.5: 71.56,48.73 TP39.TP J7.9
  Top 1: J7.9 v91.66,48.73
  Bottom 1: v91.66,48.73 J7.9
P40
  Top 0.3: IC1.65 58.4,51 58.8,50.6 RN11.8
P40_R  (via drill 0.5)
  Top 0.4: RN11.1 71.35,50.6 71.95,50 | 95.68,51.25 J3.11
  Top 0.5: 71.95,50 TP40.TP 92.15,50 93.4,51.25
  Top 1: 93.4,51.25 95.68,51.25 | v98.06,51.27 J3.11
  Bottom 1: J3.11 v98.06,51.27
P41
  Top 0.3: IC1.66 58.55,51.5 58.65,51.4 RN11.7
P41_R  (via drill 0.5)
  Top 0.4: RN11.2 71.7,51.4 71.83,51.27 77.3,51.27
  Top 0.5: J3.12 77.3,51.27 77.3,51.3 TP41.TP
  Top 1: v91.66,51.27 J3.12
  Bottom 1: J3.12 v91.66,51.27
P42
  Top 0.3: IC1.68 58.75,52.5 59.05,52.8 60.65,52.8 61.25,52.2 RN11.6
P42_R  (via drill 0.5)
  Top 0.4: RN11.3 71.4,52.2 71.8,52.6
  Top 0.5: 71.8,52.6 TP42.TP 92.2,52.6 93.41,53.81
  Top 1: 93.41,53.81 J3.13 v98.06,53.81
  Bottom 1: J3.13 v98.06,53.81
P43
  Top 0.3: RN11.5 61.4,53 61.05,53.35 58.85,53.35 58.5,53 IC1.69
P43_R  (via drill 0.5)
  Top 0.4: RN11.4 70.8,53 71.61,53.81
  Top 0.5: 71.61,53.81 77.3,53.81 | 77.3,53.81 J3.14 | TP43.TP 77.3,53.8 77.3,53.81
  Top 1: v91.66,53.81 J3.14
  Bottom 1: J3.14 v91.66,53.81
P44
  Top 0.3: IC1.71 61.22,54 61.37,53.85 RN12.8
P44_R  (via drill 0.5)
  Top 0.4: RN12.1 70.15,53.85 71.35,55.05 TP44.TP
  Top 0.5: TP44.TP 92.1,55.05 93.4,56.35
  Top 1: 93.4,56.35 J3.15 v98.06,56.35
  Bottom 1: J3.15 v98.06,56.35
P45
  Top 0.3: IC1.72 61.15,54.5 61.3,54.65 RN12.7
P45_R  (via drill 0.5)
  Top 0.4: RN12.2 69.45,54.65 71.15,56.35
  Top 0.5: 71.15,56.35 77.2,56.35 | 77.2,56.35 J3.16 | TP45.TP 77.2,56.4 77.2,56.35
  Top 1: J3.16 v91.66,56.35
  Bottom 1: v91.66,56.35 J3.16
P46
  Top 0.3: IC1.74 60,55.5 60.05,55.45 RN12.6
P46_R  (via drill 0.5)
  Top 0.4: RN12.3 68.65,55.45 70.8,57.6
  Top 0.5: 70.8,57.6 TP46.TP 92.15,57.6 93.44,58.89
  Top 1: 93.44,58.89 J3.17 v98.06,58.89
  Bottom 1: J3.17 v98.06,58.89
P47
  Top 0.3: IC1.75 60,56 60.25,56.25 RN12.5
P47_R  (via drill 0.5)
  Top 0.4: RN12.4 67.87,56.25 70.51,58.89
  Top 0.5: 70.51,58.89 TP47.TP J3.18
  Top 1: v91.66,58.89 J3.18
  Bottom 1: J3.18 v91.66,58.89
P48
  Top 0.3: IC1.77 55.5,58.45 57.9,60.85 RN13.8
P48_R  (via drill 0.5)
  Top 0.4: RN13.1 57.9,67.85 60.15,70.1 TP48.TP | 60.15,79.1 60.15,92.4 58.89,93.66
  Top 0.406: TP48.TP 60.15,79.1
  Top 1: 58.89,93.66 J4.3 v58.89,98.06
  Bottom 1: J4.3 v58.89,98.06
P49
  Top 0.3: IC1.78 55,58.85 57.1,60.95 RN13.7
P49_R  (via drill 0.5)
  Top 0.4: RN13.2 57.1,68.8 58.89,70.59 TP49.TP | 58.89,77.6 J4.4
  Top 0.406: TP49.TP 58.89,77.6
  Top 1: v58.89,91.7 J4.4
  Bottom 1: J4.4 v58.89,91.7
P50
  Top 0.3: IC1.80 54,58.7 56.3,61 RN13.6
P50_R  (via drill 0.5)
  Top 0.4: RN13.3 56.3,69.6 57.65,70.95 TP50.TP | 57.65,79.1 57.65,92.35 56.35,93.65
  Top 0.406: TP50.TP 57.65,79.1
  Top 1: v56.35,98.06 J4.5 56.35,93.65
  Bottom 1: J4.5 v56.35,98.06
P51
  Top 0.3: IC1.81 53.5,59.1 55.5,61.1 RN13.5
P51_R  (via drill 0.5)
  Top 0.4: RN13.4 55.5,70.5 56.35,71.35 TP51.TP | 56.35,77.6 J4.6
  Top 0.406: TP51.TP 56.35,77.6
  Top 1: v56.35,91.7 J4.6
  Bottom 1: J4.6 v56.35,91.7
P52
  Top 0.3: IC1.83 52.5,59.05 53.8,60.35 RN14.8
P52_R  (via drill 0.5)
  Top 0.4: RN14.1 53.8,70.4 55.1,71.7 TP52.TP | 55.1,79.3 55.1,92.3 53.81,93.59
  Top 0.406: TP52.TP 55.1,79.3
  Top 1: v53.81,98.06 J4.7 53.81,93.59
  Bottom 1: J4.7 v53.81,98.06
P53
  Top 0.3: IC1.84 52,59.55 53,60.55 RN14.7
P53_R  (via drill 0.5)
  Top 0.4: RN14.2 53,71.35 53.81,72.16 TP53.TP J4.8
  Top 1: v53.81,91.7 J4.8
  Bottom 1: J4.8 v53.81,91.7
P54
  Top 0.3: IC1.86 51,59.5 52.2,60.7 RN14.6
P54_R  (via drill 0.5)  (1 unrouted)
  Top 0.4: RN14.3 52.2,72.55 | 52.55,75.5 52.55,92.25 51.27,93.53
  Top 0.406: 52.55,75.5 52.55,72.9 52.2,72.55
  Top 1: v51.27,98.06 J4.9 51.27,93.53
  Bottom 1: J4.9 v51.27,98.06
P55
  Top 0.3: IC1.87 50.5,59.95 51.4,60.85 RN14.5
P55_R  (via drill 0.5)
  Top 0.4: RN14.4 51.4,72.6 51.27,72.73 TP55.TP | 51.27,78 J4.10
  Top 0.406: TP55.TP 51.27,78
  Top 1: v51.27,91.7 J4.10
  Bottom 1: J4.10 v51.27,91.7
P56
  Top 0.3: IC1.89 49.5,60.42 49.7,60.62 RN16.8
P57
  Top 0.3: IC1.90 49,60.46 48.9,60.56 RN16.7
P58
  Top 0.3: IC1.92 48,59.83 48.1,59.93 RN16.6
P58_R  (via drill 0.3)
  Top 0.3: 48.09,62.63 RN16.3
  Top 0.4: 29.96,73.58 IC2.2 | IC2.2 | IC2.2 33.04,70.5 36.26,70.5 v39.2,67.56 | v44.53,72.9 48.1,69.33 RN16.3
  Top 0.5: 29.96,73.58 29.96,74.06 | R4.1 29.96,74.06 | 29.96,74.06 | v44.53,72.9 TP58.TP
  Bottom 0.4: v39.2,67.56 v44.53,72.9
P59
  Top 0.3: IC1.93 47.5,59.81 47.3,60.02 RN16.5
P59_R  (via drill 0.3)
  Top 0.3: 35.17,76.76 37.44,74.49 | v40.03,71.91 v40.03,71.9 | 37.44,74.57 37.44,74.49 | 37.37,74.49 37.44,74.49 | 47.29,64.64 47.3,64.64
  Top 0.4: RN16.4 47.3,64.64 | v40.03,71.9 47.29,64.64
  Top 0.5: 37.44,74.49 v40.03,71.91 | J9.6 37.44,74.57 | J9.8 37.37,74.49 | 33.57,78.37 31.4,80.53 30.49,80.53 X1.3 | 33.57,78.37 35.17,76.76 | IC2.5 v33.82,66.14 v33.81,66.14 | TP59.TP 33.57,78.62 33.57,78.37
  Bottom 0.5: v40.03,71.9 34.27,66.14 v33.81,66.14
P60
  Top 0.3: IC1.95 46.5,60.1 45.55,61.05 RN15.8
P60_R  (via drill 0.3)
  Top 0.3: v31.07,81.55 31.03,81.55
  Top 0.4: v44.9,64.5 45.55,63.85 RN15.1
  Top 0.5: X1.2 31.03,81.55 v31.07,81.55 32.3,81.55 TP60.TP | v33.7,67.55 34.2,67.55 IC2.6 37.25,64.5 v39.47,64.5
  Bottom 0.5: v33.7,67.55 31.07,70.17 v31.07,81.55 | v44.9,64.5 v39.47,64.5
P61
  Top 0.3: IC1.96 46,59.75 44.75,61 RN15.7
P61_R  (via drill 0.3, 0.5)
  Top 0.3: 33.83,83.49 v33.83,83.54 | v38.48,72.08 | 40.65,74.85 38.3,77.2
  Top 0.4: RN15.2 44.75,63.45 42.3,65.9 42.3,68.25
  Top 0.5: 38.3,77.2 J9.3 35.31,82.01 | 35.31,82.01 33.83,83.49 | v40.65,74.25 40.65,74.85 | TP61.TP 35.31,82.01 | 42.3,68.25 v38.48,72.08 | X1.5 v28.1,79.82 v28.1,79.81
  Bottom 0.5: v28.1,79.81 31.83,83.54 v33.83,83.54 | v38.48,72.08 v40.65,74.25
P62
  Top 0.3: IC1.98 45,58.75 43.95,59.8 RN15.6
P63
  Top 0.3: IC1.99 44.5,58.5 43.15,59.85 RN15.5
RESET_N  (via drill 0.3, 0.5)
  Top 0.3: 44,57.97 IC1.100 44,58.2 41.8,60.4
  Top 0.5: v39.46,69.78 41.42,67.81 41.42,60.77 41.8,60.4
  Top 1: J8.17 v41.11,86.94 v41.1,86.94
  Bottom 0.5: 41.89,72.21 v39.46,69.78
  Bottom 0.8: R16.1 J9.2
  Bottom 1: J8.17 v41.1,86.94 41.1,86.4 41.89,85.61 | 41.89,85.61 | 41.89,85.61 J9.2 41.89,72.21
RTC_SCL  (via drill 0.3)
  Top 0.4: RN16.1 49.7,63.88 v50.52,64.7 | 69.41,63.26 IC6.8
  Top 0.5: 69.41,63.26 v69.95,63.8 70,63.8 TP56.TP
  Bottom 0.4: v50.52,64.7 64.3,64.7 67.1,61.9 68.05,61.9 v69.95,63.8
RTC_SDA  (via drill 0.3)
  Top 0.4: RN16.2 48.9,64.7 50,65.8 v50.5,65.8 | v67.4,63.35
  Top 0.5: IC6.7 v67.4,63.35 67.4,65.15 TP57.TP
  Bottom 0.4: v50.5,65.8 64.95,65.8 v67.4,63.35
RXD  (via drill 0.3, 0.5)
  Top 0.5: RN15.4 v42.45,62.62 | J10.2 17.21,72.51 | 17.21,72.51 19.7,70.02 22,70.02 | 22,70.02 24.5,70.02 35.06,59.46 v36.31,59.46 | TP63.TP 22,70.02 | R5.1 17.16,72.51 17.21,72.51
  Top 1: J8.20 v38.57,98.06
  Bottom 0.5: v42.45,62.62 39.48,62.62 v36.31,59.46 | J10.2 15.52,76.76 31.43,92.67 37.51,92.67
  Bottom 1: v38.57,98.06 J8.20 38.57,93.72 37.51,92.67
SD_DOUT
  Top 0.5: X1.7 | X1.7 25.82,78.98 25.82,78.2 R4.2
TXD  (via drill 0.3, 0.5)
  Top 0.4: RN15.3 43.95,63.06 v43.48,63.53
  Top 0.5: v35.73,60.52 24.66,71.6 21.71,71.6 20.21,73.11 | 20.21,73.11 19.08,74.23 | 19.08,74.23 J10.1 | TP62.TP 20.21,73.16 20.21,73.11 | R6.1 19.08,74.19 19.08,74.23
  Top 1: 38.57,90.06 J8.19 v38.57,86.94
  Bottom 0.5: v43.48,63.53 38.74,63.53 v35.73,60.52
  Bottom 1: J10.1 21.12,76 32.06,86.94 v38.57,86.94 J8.19
U_1V8  (via drill 0.3, 0.5)  (1 unrouted)
  Top 0.3: 56.52,50.5 v56.65,50.5 IC1.64 | IC1.2 v43.35,55.5 | v53,56.66 v52.99,56.65 IC1.82 | IC1.94 v47,56.65 | v50,56.65 IC1.88 | v53,43.35 IC1.44 | v47,43.35 IC1.32 | v44,43.35 IC1.26 | v43.35,52.5 IC1.8 | v43.35,46.5 IC1.20 | IC1.76 v56,56.65 | IC1.70 v56.65,53.5 | IC1.52 v56.65,44.5 | IC1.58 v56.65,47.5 | IC1.38 v50,43.35 | IC1.14 v43.35,49.5
  Top 1: v48.73,98.06 J4.11 J4.12 v48.73,86.9
  Bottom 0.3: 56.65,56.65
  Bottom 0.4: 53.81,56.65 v52.99,56.65
  Bottom 1: v56.65,50.5 v56.65,47.5 v56.65,44.5 56.65,43.35 | v56.65,50.5 v56.65,53.5 56.65,56.65 | v50,43.35 v53,43.35 56.65,43.35 | v50,43.35 v47,43.35 v44,43.35 43.35,43.35 | v50,56.65 v52.99,56.65 v56,56.65 56.65,56.65 | 48.2,56.65 v47,56.65 43.35,56.65 | 48.2,56.65 v50,56.65 | v43.35,49.5 v43.35,52.5 v43.35,55.5 43.35,56.65 | v43.35,49.5 v43.35,46.5 43.35,43.35 | C1.1 56.65,43.35 | C5.1 v50,43.35 | C6.1 v43.35,49.5 | C7.1 v50,56.65 | C8.1 v56.65,50.5 | C3.1 43.35,43.35 | C4.1 43.35,56.65 | 56.65,56.65 | 56.65,56.65 C2.1 | 48.2,56.65 48.2,62.1 49.3,63.2 49.3,77.85 48.73,78.42 v48.73,86.9 | v48.73,98.06 J4.12 v48.73,86.91
U_3V3  (via drill 0.3, 0.5, 0.6)
  Top 0.3: 55.85,52 IC1.67 59.26,52 v59.37,52.12 | IC1.73 55.85,55 | IC1.85 51.5,55.85 | 45.5,55.85 IC1.97 45.5,59.24 v45.22,59.52 | IC1.55 55.85,46 | 55.85,49 IC1.61 | 51.5,44.15 IC1.41 v51.5,40.79 v51.49,40.78 | IC1.35 48.5,44.15 | 44.15,48 IC1.17 | IC1.23 44.15,45 | IC1.5 44.15,54 | v40.49,51.25 40.74,51 IC1.11 44.15,51 | 43.02,43.41 43.75,44.15 44.15,44.15 | 56.77,56.77 56.77,56.38 56.24,55.85 | IC1.29 45.5,44.15 | 23.82,77.99 23.82,78 | IC1.79 54.5,55.85 | IC1.47 54.5,44.15 | IC1.91 48.5,55.85
  Top 0.5: 55.85,55.85 55.85,55 55.85,52 55.85,49 55.85,46 55.85,44.15 54.5,44.15 51.5,44.15 48.5,44.15 45.5,44.15 44.15,44.15 44.15,45 44.15,48 44.15,51 44.15,54 | 55.85,55.85 54.5,55.85 51.5,55.85 48.5,55.85 45.5,55.85 | IC2.7 IC2.8 38.8,66.54 v38.8,66.17 | C12.1 56.77,56.77 | 56.24,55.85 55.85,55.85 | 23.82,77.99 24.11,77.99 25.92,76.19 25.92,75.83 26.62,75.12 | 23.82,78 v21.53,80.3 | 26.62,75.12 IC2.3 32.16,69.59 33.95,69.59 IC2.7 | v25.39,84.15 25.39,84.08 X1.4 R3.2 | IC2.7 | C11.1 42.17,42.57 43.02,43.41 | R7.1 R5.2 v18.05,69.6 | v26.2,74.7 26.62,75.12 | 26.62,75.12 | v18.05,69.6 | R6.2 v20.1,71.4 | v20.1,71.4 | 66.1,64.65 IC6.2 | R1.2 v46.08,69.17
  Top 0.6: C9.1 55.85,44.12 55.85,44.15 | 63.75,67 IC6.2
  Top 0.8: 60.1,57.2 66.1,63.2 66.1,64.65 | v70.5,72.1 67.35,72.1 63.75,68.5 63.75,67
  Top 1: v46.19,98.06 J4.13 J4.14 v46.19,86.9 46.19,98.04 v46.2,98.05 | 60.1,57.2 58.46,57.2 C12.1
  Bottom 0.5: v25.39,84.15 v21.54,80.3 v21.53,80.3 | v40.49,51.25 40.74,51.49 C10.1 | C13.1 52.72,40.78 v51.49,40.78 | C16.1 59.27,53.24 59.27,52.22 v59.37,52.12 | C14.1 46.35,59.52 v45.22,59.52 | v18.05,69.6 19.85,71.4 v20.1,71.4 23.4,74.7 v26.2,74.7 | 47.16,71.55 46.08,70.45 | v46.08,69.17 45.66,69.58 45.2,69.58
  Bottom 0.8: D1.A v70.5,72.1
  Bottom 1: J4.13 v46.19,98.06 J4.14 46.19,86.88 v46.19,86.9 | C10.1 40.74,54.56 37.31,57.99 36,57.99 34.17,59.82 34.17,61.53 v38.8,66.17 41.78,66.17 45.2,69.58 47.16,71.55 47.16,76.69 46.2,77.65 R16.2 v46.19,86.9
U_5V  (via drill 0.5)
  Top 1: v43.65,86.94 J8.15 J8.16 v43.66,98.06
  Bottom 1: J8.16 J8.15 v43.65,86.94 | J8.16 v43.66,98.06
VBAT  (via drill 0.3)
  Top 0.6: IC6.6 68.8,60.15
  Top 0.8: 68.8,60.15 70.15,60.15 76.35,66.35 v76.35,70.25
  Bottom 0.6: 76.41,72.16 D1.C | v76.35,70.25 v76.36,70.25
  Bottom 0.8: R15.1 76.41,72.16 | v76.36,70.25 D1.C
VCAP
  Bottom 0.8: R15.2 79.41,75.83 C15.+
XIN
  Top 0.3: IC1.51 57.94,44 61.63,40.31 Q1.P$2
XOUT
  Top 0.3: IC1.50 56,42.06 59.69,38.37 Q1.P$1

### Text on the board
tPlace: uSD | P54 | P52 | P50 | P48 | P55 | P53 | P51 | P49 | P0 | P1 | P47 | P2 | P46 | P3 | P45 | P4 | P44 | P5 | P43 | P6 | P42 | P7 | P41 | P8 | P40 | P9 | P39 | P10 | P38 | P11 | P37 | P12 | P36 | P13 | P35 | P14 | P34 | P15 | P33 | P32 | P17 | P19 | P21 | P23 | P25 | P27 | P29 | P31 | RedQueen2 / DPU v1.0 / 07.06.2022 / D.Madlener | P16 | P18 | P20 | P22 | P24 | P26 | P28 | P30